# Altium schematic sheet 9 Axis Sensor.SchDoc
size A4; SheetNumber: 1; SheetTotal: 1
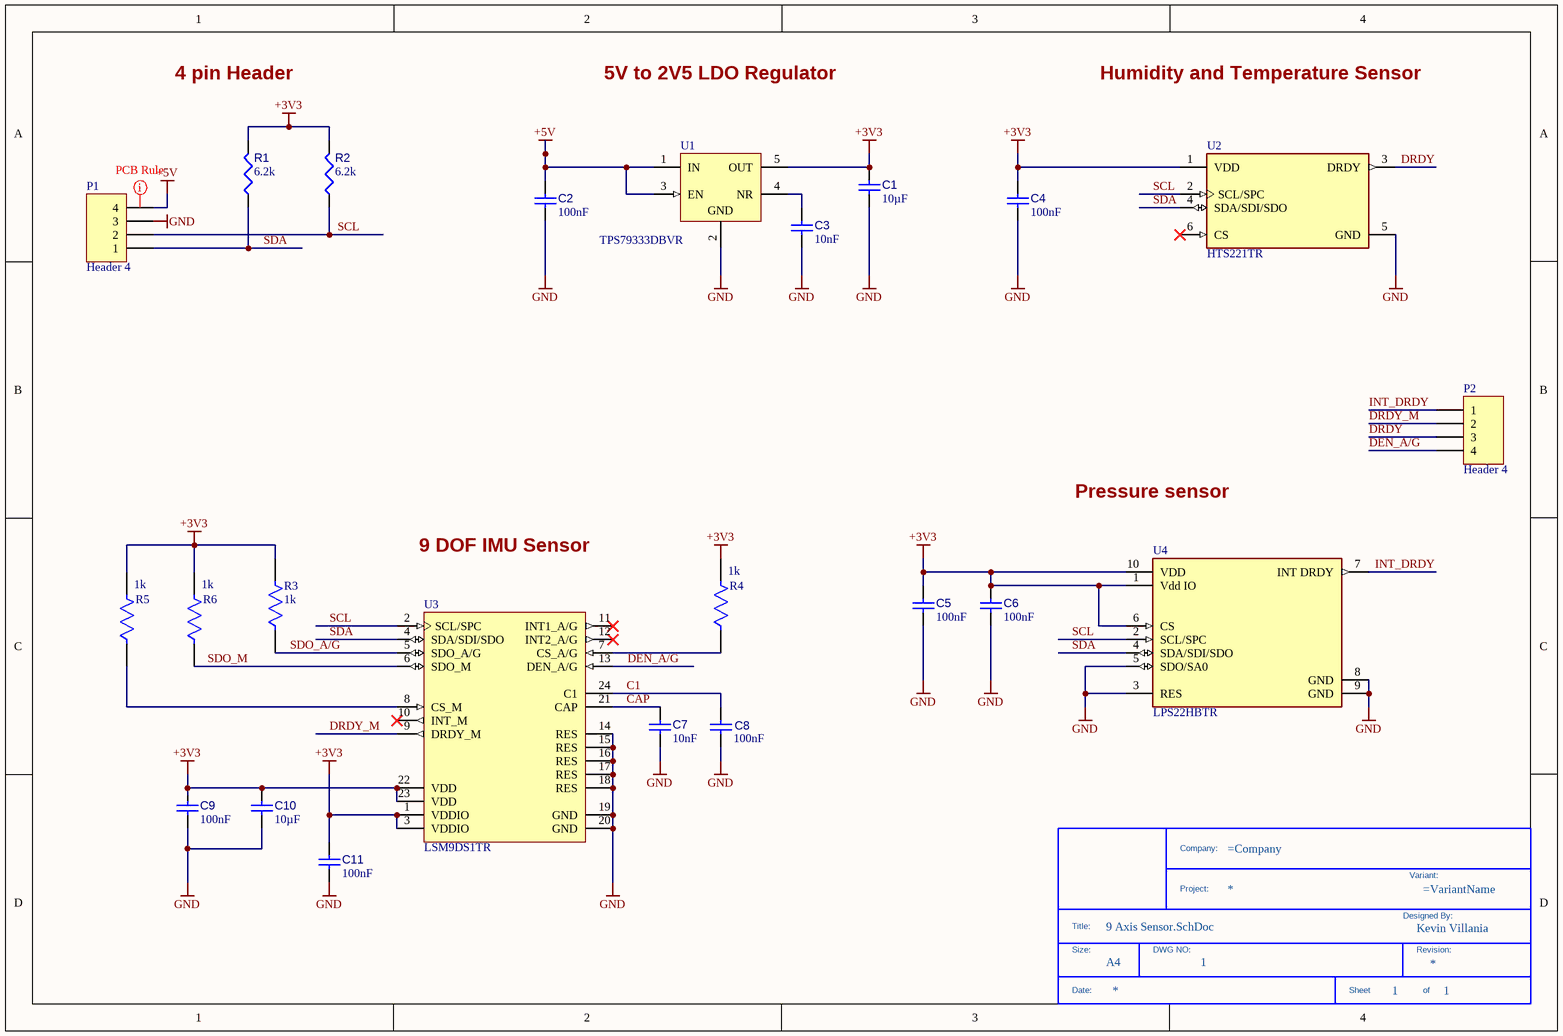
[diagram p0: 9 Axis Sensor.SchDoc]

## Parts
*  Designed By: Kevin Villania  DWG NO: 1  Size: A4  (hidden comment: Title Block)  (graphical)
C1  value 10µF  [CAPC0402(1005)60_L]  (hidden comment: Capacitor 10µF +/-40% 6.3V 0402)
C2  value 100nF  [CAPC0402(1005)60_L]  (hidden comment: Capacitor 100nF +/-20% 10V 0402)
C3  value 10nF  [CAPC0402(1005)60_L]  (hidden comment: Capacitor 10nF +/-20% 50V 0402)
C4  value 100nF  [CAPC0402(1005)60_L]  (hidden comment: Capacitor 100nF +/-20% 10V 0402)
C5  value 100nF  [CAPC0402(1005)60_L]  (hidden comment: Capacitor 100nF +/-20% 10V 0402)
C6  value 100nF  [CAPC0402(1005)60_L]  (hidden comment: Capacitor 100nF +/-20% 10V 0402)
C7  value 10nF  [CAPC0402(1005)60_L]  (hidden comment: Capacitor 10nF +/-20% 50V 0402)
C8  value 100nF  [CAPC0402(1005)60_L]  (hidden comment: Capacitor 100nF +/-20% 10V 0402)
C9  value 100nF  [CAPC0402(1005)60_L]  (hidden comment: Capacitor 100nF +/-20% 10V 0402)
C10  value 10µF  [CAPC0603(1608)100_L]  (hidden comment: Capacitor 10µF +/-20% 10V 0603)
C11  value 100nF  [CAPC0402(1005)60_L]  (hidden comment: Capacitor 100nF +/-20% 10V 0402)
P1  Header 4  [HDR1X4]
P2  Header 4  [HDR1X4]
R1  value 6.2k  [RESC0402(1005)_L]  (hidden comment: Resistor 6K2  +/-5 % 0402 63 mW)
R2  value 6.2k  [RESC0402(1005)_L]  (hidden comment: Resistor 6K2  +/-5 % 0402 63 mW)
R3  1k  [FP-RC1005-IPC_A]
R4  1k  [FP-RC1005-IPC_A]
R5  1k  [FP-RC1005-IPC_A]
R6  1k  [FP-RC1005-IPC_A]
U1  TPS79333DBVR  [DBV0005A_M]
U2  HTS221TR  [FP-HTS221TR-MFG]
U3  LSM9DS1TR  [STM-LGA-24_3500X3000X1000]
U4  LPS22HBTR  [FP-HLGA-10L-8479831-0]

## Nets
+3V3: C1.2 C4.1 C5.1 C6.1 C9.1 C10.2 C11.1 R1.2 R2.2 R3.2 R4.2 R5.2 R6.2 U1.5(OUT) U2.1(VDD) U3.1(VDDIO) U3.3(VDDIO) U3.22(VDD) U3.23(VDD) U4.1(Vdd_IO) U4.6(CS) U4.10(VDD)
+5V: C2.1 P1.4 U1.1(IN) U1.3(EN)
GND: C1.1 C2.2 C3.1 C4.2 C5.2 C6.2 C7.1 C8.2 C9.2 C10.1 C11.2 P1.3 U1.2(GND) U2.5(GND) U3.14(RES) U3.15(RES) U3.16(RES) U3.17(RES) U3.18(RES) U3.19(GND) U3.20(GND) U4.3(RES) U4.5(SDO/SA0) U4.8(GND) U4.9(GND)
C1: C8.1 U3.24(C1)
CAP: C7.2 U3.21(CAP)
DEN_A/G: P2.4 U3.13(DEN_A/G)
DRDY: P2.3 U2.3(DRDY)
DRDY_M: P2.2 U3.9(DRDY_M)
INT_DRDY: P2.1 U4.7(INT_DRDY)
SCL: P1.2 R2.1 U2.2(SCL/SPC) U3.2(SCL/SPC) U4.2(SCL/SPC)
SDA: P1.1 R1.1 U2.4(SDA/SDI/SDO) U3.4(SDA/SDI/SDO) U4.4(SDA/SDI/SDO)
SDO_A/G: R3.1 U3.5(SDO_A/G)
SDO_M: R6.1 U3.6(SDO_M)
NetC3_2: C3.2 U1.4(NR)
NetR4_1: R4.1 U3.7(CS_A/G)
NetR5_1: R5.1 U3.8(CS_M)

Not connected (* = marked no-connect by the designer): U2 6(CS)*; U3 10(INT_M)* 11(INT1_A/G)* 12(INT2_A/G)*

## Layout directives
rule Width Constraint [Pref Width = 30mil    Min Width = 30mil    Max Width = 30mil]: (no net found under the mark)

## Notes on the sheet
- 4 pin Header
- 5V to 2V5 LDO Regulator
- Humidity and Temperature Sensor
- Pressure sensor
- 9 DOF IMU Sensor
- (in symbol Title Block) Company:; Variant:; Project:; Designed By:; Title:; Size:; DWG NO:; Revision:; Date:; Sheet; of

## Library data of the parts
* = Title Block: Standard Title Block
C1 = CMP-001-00074-3: Chip Capacitor, 10µF +/-40%, 6.3V, 0402, Thickness 0.6 mm; Tolerance: 10%; Case/Package: 0402; Pins: 2; Mounting Technology: SMT; Voltage Rating: 6.3V; Max Operating Temperature: 85°C; Min Operating Temperature: -55°C
C2 C4-C6 C8 C9 C11 = CMP-001-00061-3: Chip Capacitor, 100nF +/-20%, 10V, 0402, Thickness 0.6 mm; Tolerance: 20%; Mounting Technology: SMT; Voltage Rating: 10V; Max Operating Temperature: 85°C; Pins: 2; Case/Package: 0402; Min Operating Temperature: -55°C
C3 C7 = CMP-001-00069-3: Chip Capacitor, 10nF +/-20%, 50V, 0402, Thickness 0.6 mm; Tolerance: 5%; Max Operating Temperature: 85°C; Pins: 2; Case/Package: 0402; Voltage Rating: 50V; Min Operating Temperature: -55°C; Mounting Technology: SMT
C10 = CMP-001-00075-4: Chip Capacitor, 10µF +/-20%, 10V, 0603, Thickness 1 mm; Tolerance: 10%; Voltage Rating: 10V; Max Operating Temperature: 85°C; Pins: 2; Case/Package: 0603; Mounting Technology: SMT; Min Operating Temperature: -55°C
P1 P2 = Header 4: Header, 4-Pin; LatestRevisionDate: 17-Jul-2002; LatestRevisionNote: Re-released for DXP Platform.; Publisher: Altium Limited
R1 R2 = CMP-009-00147-3: Chip Resistor, 6,2 kOhms, +/-5 %, 63 mW, -55 to 155 degC, 0402; Tolerance: 5%; Power: 63mW; Min Operating Temperature: -55°C; Pins: 2; Max Operating Temperature: 155°C; Case/Package: 0402
R3-R6 = CMP-13261-004451-1: Res Thick Film 0402 1kΩ 1% 0.063W ±100ppm/°C Molded SMD T/R; Voltage Rating (DC): 50V; Max Power Dissipation: 63mW; Resistance: 1kR; Composition: Thick Film; Lead Free: Lead Free; Max Operating Temperature: 155°C; Height: 0.016inch; Number of Terminations: 2; Features: Moisture Resistant; Min Operating Temperature: -55°C; Temperature Coefficient: 100ppm/°C; Case Code (Imperial): 0402; Radiation Hardening: No; Military Standard: Not; Depth: 0.5mm; Tolerance: 1%; Case/Package: 0402; Case Code (Metric): 1005; Packaging: Tape and Reel; Length: 1mm; Width: 0.02inch; Contact Plating: Tin
U1 = CMP-0394-00364-2: Single Output High PSRR LDO, 200 mA, Fixed 3.3 V Output, 2.7 to 5.5 V Input, 5-pin SOT-23 (DBV), -40 to 85 degC, Green (RoHS & no Sb/Br); Manufacturer: Texas Instruments; Iout(Max)(A): 0.2; Rating: Catalog; Vin(Min)(V): 2.7; Vdo(Typ)(mV): 102; Fixed Output Options(V): 3.3; Accuracy(%): 2; SubFamily: Single Channel LDO; Vin(Max)(V): 5.5; ComponentLink1URL: http://www.ti.com/; ComponentLink2URL: http://www.ti.com/general/docs/lit/getliterature.tsp?genericPartNumber=TPS79333&fileType=pdf; ComponentLink1Description: Manufacturer URL; PackageDescription: 5-Pin Plastic Small Outline, Body 1.60 Ãƒâ€” 2.90 mm, Pitch 0.95 mm; ComponentLink3URL: http://www.ti.com/litv/pdf/mpds018i; ComponentLink2Description: Datasheet; Mounting Technology: Surface Mount; ComponentLink3Description: Package Specification; PackageReference: DBV0005A; Code_JEDEC: MO-178; PartNumber: TPS79333DBVR; Vout Adj(Min)(V): 3.3; DatasheetVersion: SLVS348K; Eco-Plan: Green (RoHS & no Sb/Br); PackageVersion: 4073253-4/K; Vout Adj(Max)(V): 3.3; Iq(Typ)(mA): 0.2
U2 = CMP-2000-06428-2: SENS HUMI/TEMP 2.5V I2C 4.5% SMD; Resolution: 16b; Response Time: 10s; Operating Supply Voltage: 3.6V; Sensor Type: Temperature; Output Type: SPI; Accuracy: 4.5%; Lead Free: Lead Free; Radiation Hardening: No; Packaging: Tape and Reel; Max Operating Temperature: 120°C; Min Operating Temperature: -40°C; Interface: I2C; Mount: Surface Mount; Number of Pins: 6
U3 = CMP-2000-06606-1: iNEMO Inertial Module: 3D Accelerometer, 3D Gyroscope, 3D Magnetometer, 1.9 to 3.6 V, -40 to 85 degC, 24-Pin LGA, RoHS, Tape and Reel; Manufacturer: STMicroelectronics; SVHC: NoSVHC(17-Dec-2015); MEMS Module Function: Tri-AxisGyroscope,Tri-AxisAccelerometer,Tri-AxisMagnetometer; Supply Voltage Max: 3.6V; No. of Pins: 24Pins; Gyroscope Range: ±245°/s,±500°/s,±2000°/s; Acceleration Range: ±2g,±4g,±8g,±16g; Supply Voltage Min: 1.9V; Package Description: 24-Pin Plastic Land Grid Array Package, Body 3.65 x 3.15 mm, Pitch 0.43 mm; Manufacturer URL: http://www.st.com/; PartNumber: LSM9DS1; Product Range: -; Packaging: CutTape; Sensor Case Style: LGA; Datasheet URL: http://www2.st.com/content/ccc/resource/technical/document/datasheet/1e/3f/2a/d6/25/eb/48/46/DM00103319.pdf/files/DM00103319.pdf/jcr:content/translations/en.DM00103319.pdf; Package Reference: LGA-24_3500X3000X1000; Mounting Technology: SurfaceMount; Datasheet Version: Rev. 3, 03/2015; MSL: MSL3-168hours
U4 = CMP-12182-000004-1: MEMS NANO PRESSURE SENSOR: 260-1; Manufacturer: STMicroelectronics; Sensor Output: I2C,SPI; Port Style: No Port; Max Supply Voltage: 3.6V; Operating Supply Current: 3-12uA; Min Supply Voltage: 1.7V; Device Class L3: unset; Device Class L1: Sensors; Manufacturer Part Number: LPS22HBTR; Temperature Range High: +85°C; Digikey Description: MEMS NANO PRESSURE SENSOR: 260-1; Device Class L2: Pressure Sensors; RoHS: TRUE; Lead Free: Yes; Height: 0.8mm; Automotive: No; Octopart: https://octopart.com/lps22hbtr-stmicroelectronics-51851131; Package: HLGA-10L-8479831; Temperature Range Low: -40°C; Category: IC; Temperature: -40°C to +85°C; ComponentLink2Description: Datasheet; ComponentLink2URL: https://www.st.com/resource/en/datasheet/lps22hb.pdf; Footprint Url: https://www.st.com/content/ccc/resource/technical/document/technical_note/73/17/9c/16/dd/96/4a/01/CD00134799.pdf/files/CD00134799.pdf/jcr:content/translations/en.CD00134799.pdf